# EAGLE board SSv3_1 (EAGLE 9.3.0), part 1 of 2
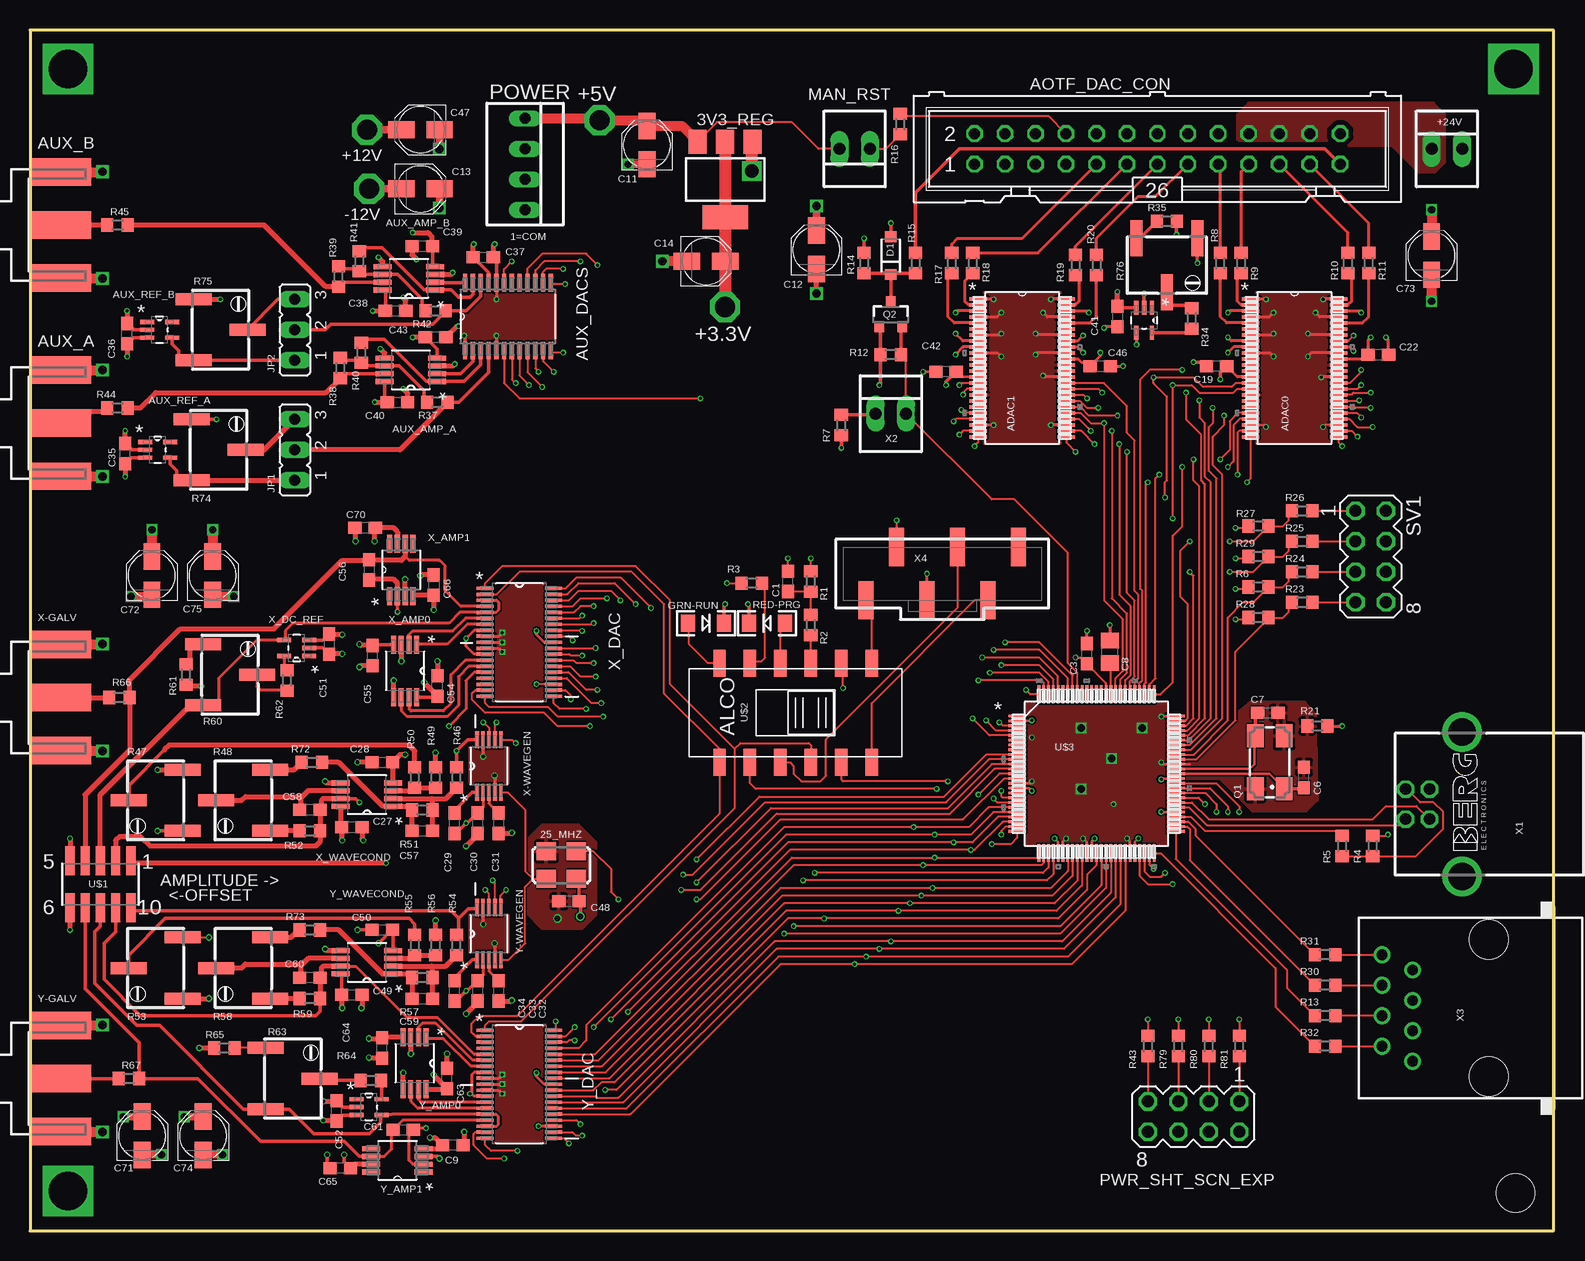
[diagram p6: board, top side]
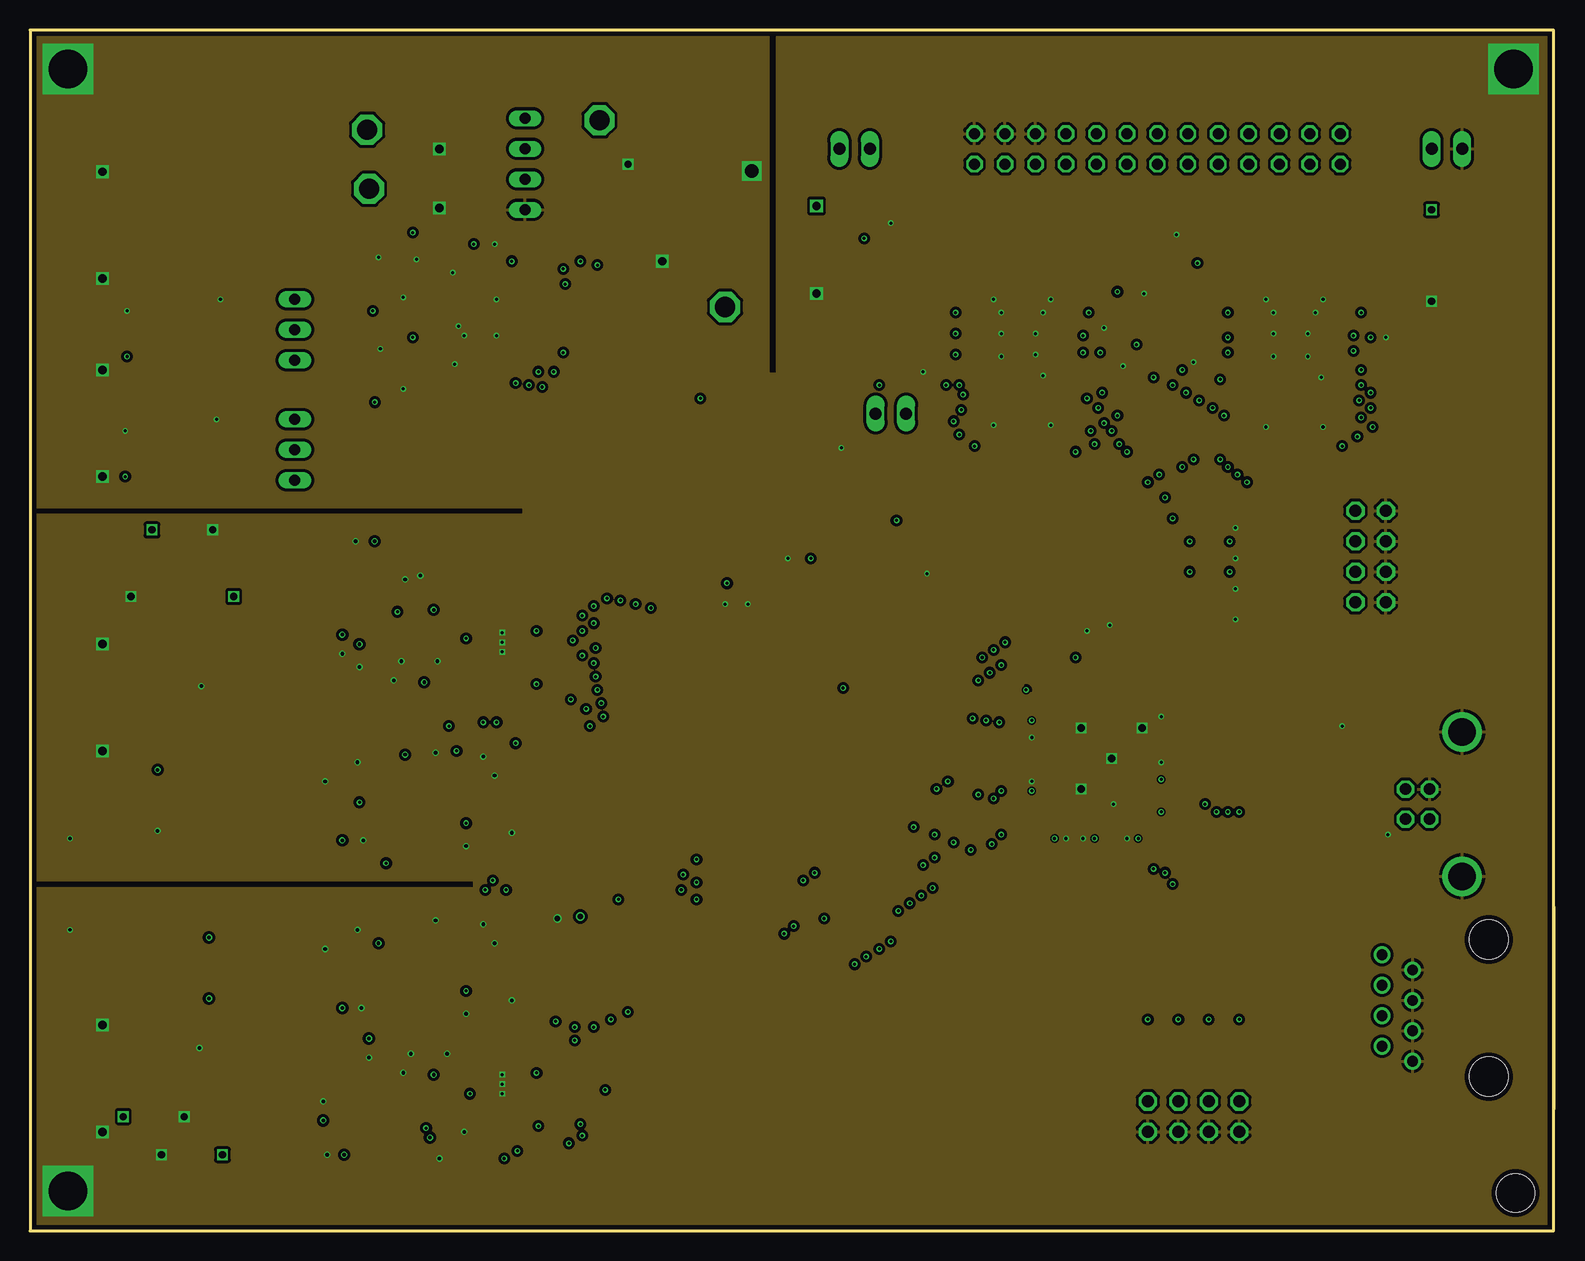
[diagram p7: board, inner layer AGND]
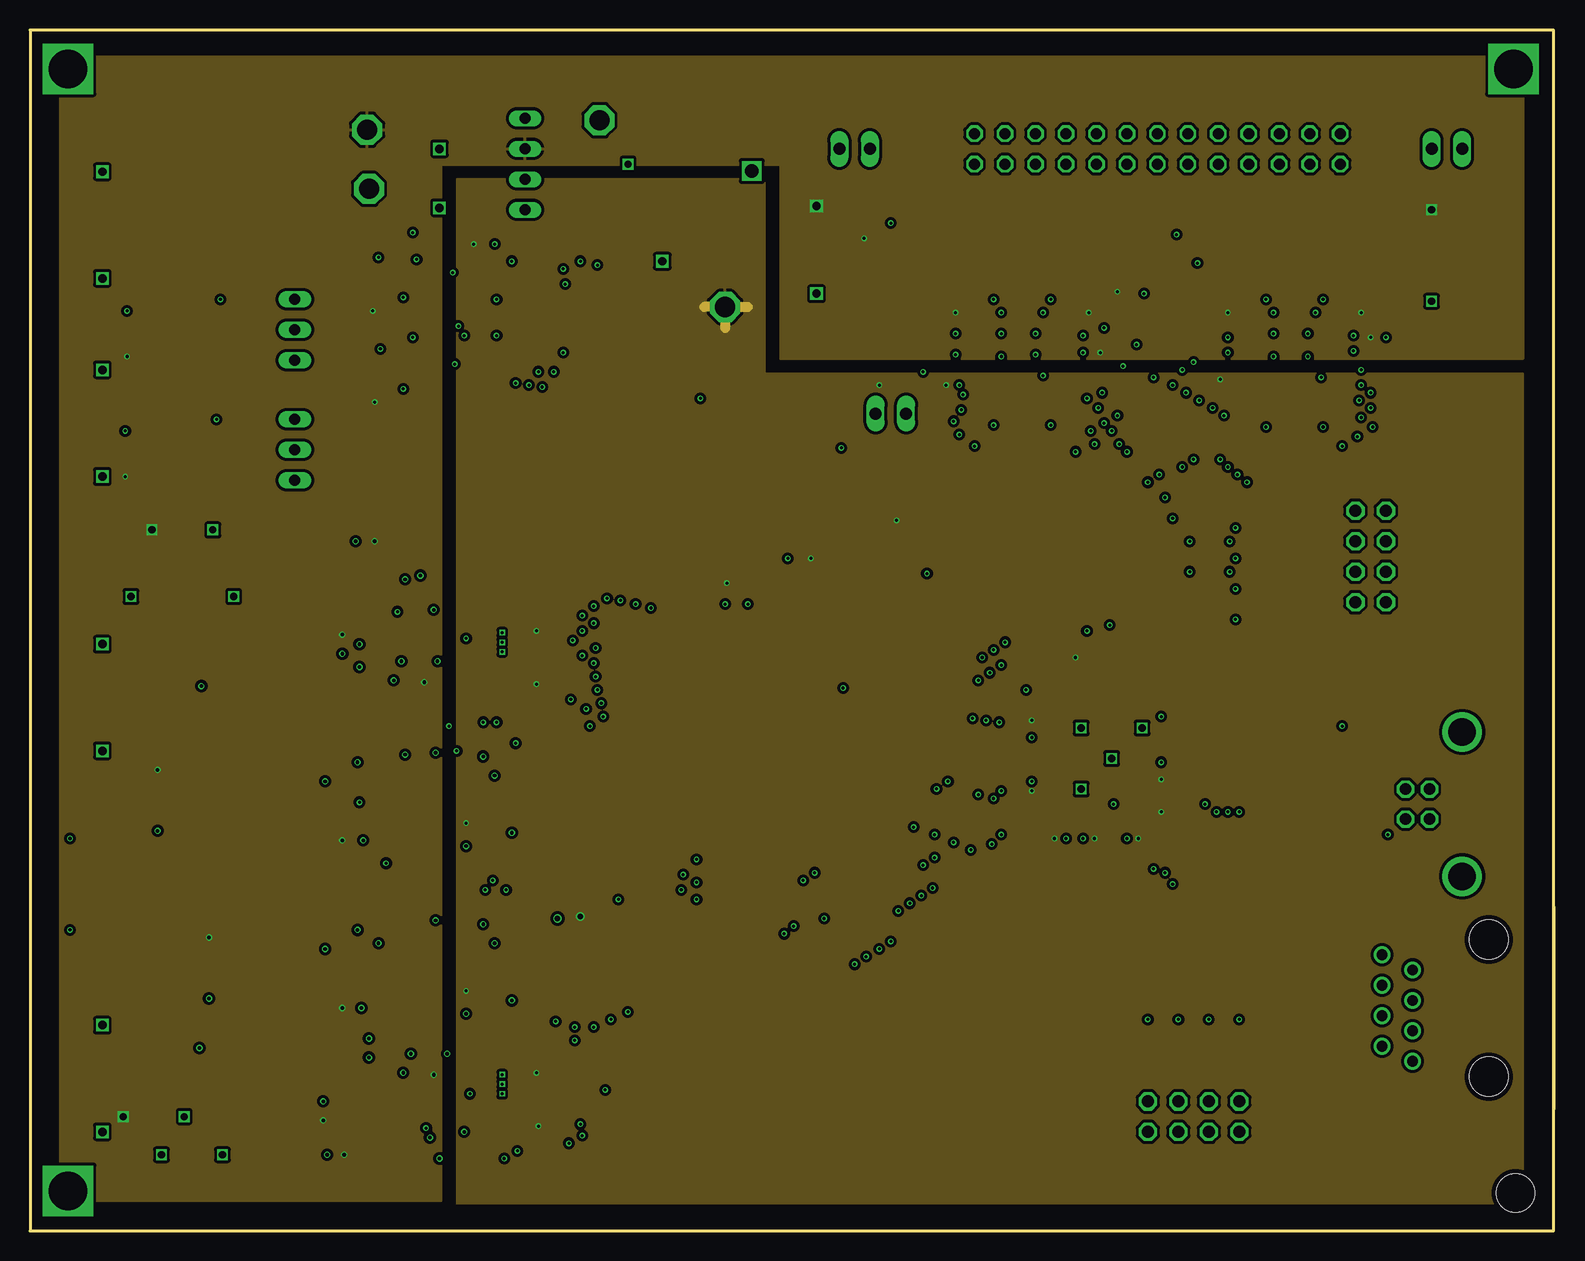
[diagram p8: board, inner layer VDD]
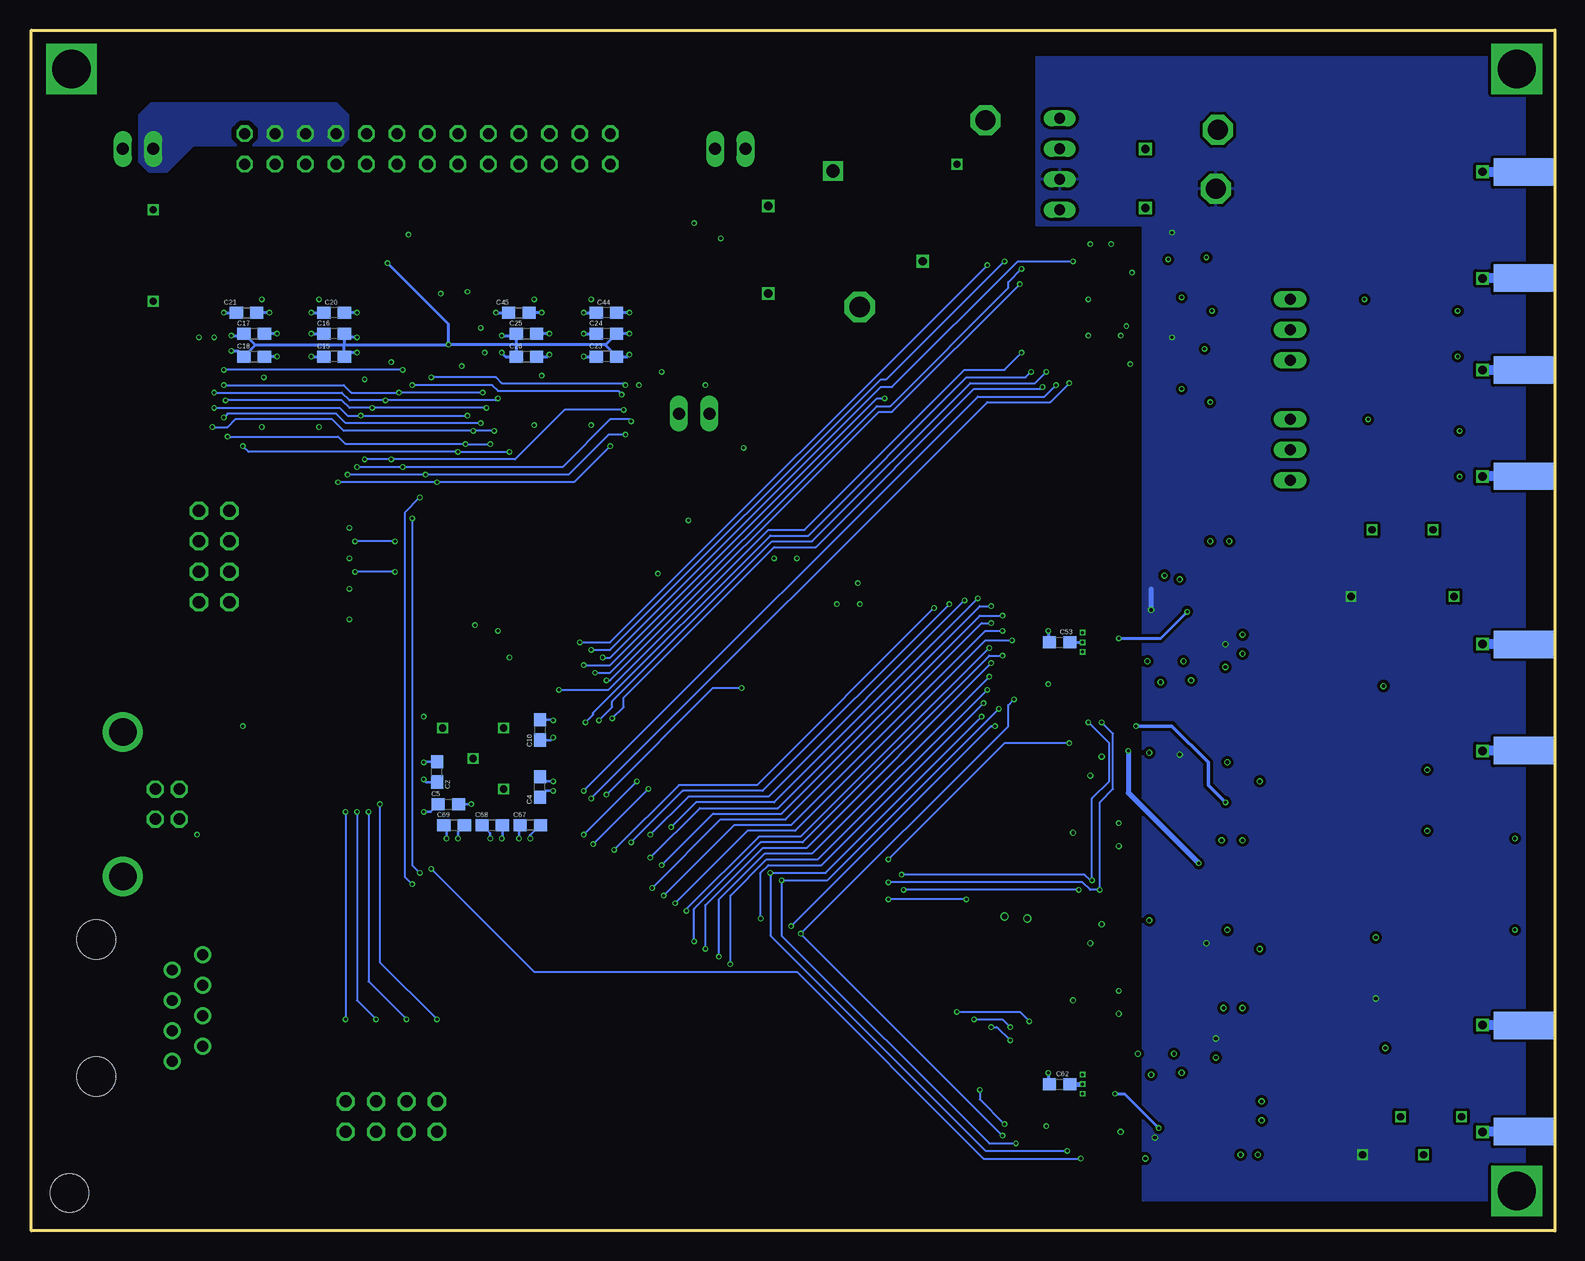
[diagram p9: board, bottom side, seen from below]

Size 127 x 100.08 mm. Coordinates in mm from the lower left corner, seen from the top.
Outline: 0,0 127,0 127,100.08 0,100.08 0,0
Copper layers (1*2*15*16): Top 0.035559375mm / dielectric 0.17018125mm / AGND 0.01778125mm / dielectric 47mil / VDD 0.01778125mm / dielectric 0.17018125mm / Bottom 0.035559375mm
Design rules "OSHPark_4layer": minimum track width 5mil, minimum drill 10mil, track to track 5mil, track to pad 5mil, pad to pad 5mil, via to via 5mil, smd to smd 5mil, copper to edge 15mil, drill to drill 6mil, minimum pad ring 4mil, minimum via ring 4mil, stop-mask expansion 2.5mil, vias tented up to drill 0mil, thermal gap 10mil
Holes 3.2 mm at 123.83,3.17
tKeepout: 2 lines

## Footprints (pad centres in the part's own frame; a part is rotated, then mirrored left to right if it is on the bottom)
SOT223 = smd 1.5 x 2: 1 -2.3,-3.15; 2 0,-3.15; 3 2.3,-3.15 | smd 3.8 x 2: 4 0,3.15
ASF = smd 1.6 x 1.5: 1 -1.25,-1.15; 2 1.25,-1.15; 3 1.25,1.15; 4 -1.25,1.15
TESTPOINT = drill 1.676 octagon: P$1 0,0
22-23-2021 = drill 1 long: 1 -1.27,0; 2 1.27,0
RV_48 = smd 1.473 x 0.279: 1 -3.67,5.75; 2 -3.67,5.25; 3 -3.67,4.75; 4 -3.67,4.25; 5 -3.67,3.75; 6 -3.67,3.25; 7 -3.67,2.75; 8 -3.67,2.25; 9 -3.67,1.75; 10 -3.67,1.25; 11 -3.67,0.75; 12 -3.67,0.25; 13 -3.67,-0.25; 14 -3.67,-0.75; 15 -3.67,-1.25; 16 -3.67,-1.75; 17 -3.67,-2.25; 18 -3.67,-2.75; 19 -3.67,-3.25; 20 -3.67,-3.75; 21 -3.67,-4.25; 22 -3.67,-4.75; 23 -3.67,-5.25; 24 -3.67,-5.75; 25 3.67,-5.75; 26 3.67,-5.25; 27 3.67,-4.75; 28 3.67,-4.25; 29 3.67,-3.75; 30 3.67,-3.25; 31 3.67,-2.75; 32 3.67,-2.25; 33 3.67,-1.75; 34 3.67,-1.25; 35 3.67,-0.75; 36 3.67,-0.25; 37 3.67,0.25; 38 3.67,0.75; 39 3.67,1.25; 40 3.67,1.75; 41 3.67,2.25; 42 3.67,2.75; 43 3.67,3.25; 44 3.67,3.75; 45 3.67,4.25; 46 3.67,4.75; 47 3.67,5.25; 48 3.67,5.75
SOT65P210X110-5N = smd 1.168 x 0.356: 1 -1.041,0.66; 2 -1.041,0; 3 -1.041,-0.66; 4 1.041,-0.66; 5 1.041,0.66
ML26 = drill 0.914 octagon: 1 -15.24,-1.27; 2 -15.24,1.27; 3 -12.7,-1.27; 4 -12.7,1.27; 5 -10.16,-1.27; 6 -10.16,1.27; 7 -7.62,-1.27; 8 -7.62,1.27; 9 -5.08,-1.27; 10 -5.08,1.27; 11 -2.54,-1.27; 12 -2.54,1.27; 13 0,-1.27; 14 0,1.27; 15 2.54,-1.27; 16 2.54,1.27; 17 5.08,-1.27; 18 5.08,1.27; 19 7.62,-1.27; 20 7.62,1.27; 21 10.16,-1.27; 22 10.16,1.27; 23 12.7,-1.27; 24 12.7,1.27; 25 15.24,-1.27; 26 15.24,1.27
SIDE_MOUNTSMA = smd 5.08 x 2.286: 1 2.565,0; G@1 2.565,4.42; G@2 2.565,-4.42 | smd 5.08 x 2.286 bottom: G@3 2.565,4.42; G@4 2.565,-4.42
SOP65P490X110-8N = smd 1.499 x 0.432: 1 -2.184,0.965; 2 -2.184,0.33; 3 -2.184,-0.33; 4 -2.184,-0.965; 5 2.184,-0.965; 6 2.184,-0.33; 7 2.184,0.33; 8 2.184,0.965
SOP65P640X120-24N = smd 1.473 x 0.356: 1 -2.819,3.581; 2 -2.819,2.921; 3 -2.819,2.286; 4 -2.819,1.626; 5 -2.819,0.965; 6 -2.819,0.33; 7 -2.819,-0.33; 8 -2.819,-0.965; 9 -2.819,-1.626; 10 -2.819,-2.286; 11 -2.819,-2.921; 12 -2.819,-3.581; 13 2.819,-3.581; 14 2.819,-2.921; 15 2.819,-2.286; 16 2.819,-1.626; 17 2.819,-0.965; 18 2.819,-0.33; 19 2.819,0.33; 20 2.819,0.965; 21 2.819,1.626; 22 2.819,2.286; 23 2.819,2.921; 24 2.819,3.581
C0603 = smd 1.1 x 1: 1 -0.85,0; 2 0.85,0
C0805 = smd 1.3 x 1.5: 1 -0.95,0; 2 0.95,0
PANASONIC_B = smd 2.2 x 1.4: + 1.6,0; - -1.6,0
SOD-123 = smd 0.9 x 0.95: A 1.575,0; C -1.575,0
LED-1206 = smd 1.2 x 1.4: A -1.5,0; C 1.5,0
JP2 = drill 0.914 long: 1 -2.54,0; 2 0,0; 3 2.54,0
22-23-2041 = drill 0.9 long: 1 3.81,0; 2 1.27,0; 3 -1.27,0; 4 -3.81,0
MA04-2 = drill 1.016 octagon: 1 -3.81,-1.27; 2 -3.81,1.27; 3 -1.27,-1.27; 4 -1.27,1.27; 5 1.27,-1.27; 6 1.27,1.27; 7 3.81,-1.27; 8 3.81,1.27
CTS406 = smd 1.9 x 1.4: 1 -2.2,-1.2; 2 2.2,-1.2; 3 2.2,1.2; 4 -2.2,1.2
SOT23-3 = smd 0.8 x 0.9: 1 -0.95,-1; 2 0.95,-1; 3 0,1.1
R0603 = smd 1 x 1.1: 1 -0.85,0; 2 0.85,0
RTRIMTS63Y = smd 1 x 3: 1 -2.55,-2.25; 2 0,2.25; 3 2.55,-2.25
SMD_HEADER_10P05_BARE = smd 0.76 x 2.4: 1 -2.54,-1.95; 2 -1.27,-1.95; 3 0,-1.95; 4 1.27,-1.95; 5 2.54,-1.95; 6 2.54,1.95; 7 1.27,1.95; 8 0,1.95; 9 -1.27,1.95; 10 -2.54,1.95
4PDT_SMD = smd 1.016 x 2.286: 1 -6.35,-4.128; 2 -3.81,-4.128; 3 -1.27,-4.128; 4 1.27,-4.128; 5 3.81,-4.128; 6 6.35,-4.128; 7 6.35,4.128; 8 3.81,4.128; 9 1.27,4.128; 10 -1.27,4.128; 11 -3.81,4.128; 12 -6.35,4.128
TQFP100_12X12MC = smd 1.473 x 0.229: 1 -6.617,4.8; 2 -6.617,4.4; 3 -6.617,4; 4 -6.617,3.6; 5 -6.617,3.2; 6 -6.617,2.8; 7 -6.617,2.4; 8 -6.617,2; 9 -6.617,1.6; 10 -6.617,1.2; 11 -6.617,0.8; 12 -6.617,0.4; 13 -6.617,0; 14 -6.617,-0.4; 15 -6.617,-0.8; 16 -6.617,-1.2; 17 -6.617,-1.6; 18 -6.617,-2; 19 -6.617,-2.4; 20 -6.617,-2.8; 21 -6.617,-3.2; 22 -6.617,-3.6; 23 -6.617,-4; 24 -6.617,-4.4; 25 -6.617,-4.8; 51 6.617,-4.8; 52 6.617,-4.4; 53 6.617,-4; 54 6.617,-3.6; 55 6.617,-3.2; 56 6.617,-2.8; 57 6.617,-2.4; 58 6.617,-2; 59 6.617,-1.6; 60 6.617,-1.2; 61 6.617,-0.8; 62 6.617,-0.4; 63 6.617,0; 64 6.617,0.4; 65 6.617,0.8; 66 6.617,1.2; 67 6.617,1.6; 68 6.617,2; 69 6.617,2.4; 70 6.617,2.8; 71 6.617,3.2; 72 6.617,3.6; 73 6.617,4; 74 6.617,4.4; 75 6.617,4.8 | smd 0.229 x 1.473: 26 -4.8,-6.617; 27 -4.4,-6.617; 28 -4,-6.617; 29 -3.6,-6.617; 30 -3.2,-6.617; 31 -2.8,-6.617; 32 -2.4,-6.617; 33 -2,-6.617; 34 -1.6,-6.617; 35 -1.2,-6.617; 36 -0.8,-6.617; 37 -0.4,-6.617; 38 0,-6.617; 39 0.4,-6.617; 40 0.8,-6.617; 41 1.2,-6.617; 42 1.6,-6.617; 43 2,-6.617; 44 2.4,-6.617; 45 2.8,-6.617; 46 3.2,-6.617; 47 3.6,-6.617; 48 4,-6.617; 49 4.4,-6.617; 50 4.8,-6.617; 76 4.8,6.617; 77 4.4,6.617; 78 4,6.617; 79 3.6,6.617; 80 3.2,6.617; 81 2.8,6.617; 82 2.4,6.617; 83 2,6.617; 84 1.6,6.617; 85 1.2,6.617; 86 0.8,6.617; 87 0.4,6.617; 88 0,6.617; 89 -0.4,6.617; 90 -0.8,6.617; 91 -1.2,6.617; 92 -1.6,6.617; 93 -2,6.617; 94 -2.4,6.617; 95 -2.8,6.617; 96 -3.2,6.617; 97 -3.6,6.617; 98 -4,6.617; 99 -4.4,6.617; 100 -4.8,6.617
PN61729-S = drill 0.95 octagon: 1 1.25,4.71; 2 -1.25,4.71; 3 -1.25,2.71; 4 1.25,2.71 | drill 2.3 pad 2.9: S1 -6.02,0; S2 6.02,0
RJ45-NO-SHIELD = drill 0.9 pad 1.4: 1 -4.445,6.35; 2 -3.175,8.89; 3 -1.905,6.35; 4 -0.635,8.89; 5 0.635,6.35; 6 1.905,8.89; 7 3.175,6.35; 8 4.445,8.89 | hole 3.251: -5.715,0; 5.715,0
74099-06 = smd 1.27 x 3.175: 1 -6.35,-2.223; 2 -3.81,2.223; 3 -1.27,-2.223; 4 1.27,2.223; 5 3.81,-2.223; 6 6.35,2.223
SOP50P490X110-10N = smd 1.422 x 0.305: 1 -2.184,0.991; 2 -2.184,0.508; 3 -2.184,0; 4 -2.184,-0.508; 5 -2.184,-0.991; 6 2.184,-0.991; 7 2.184,-0.508; 8 2.184,0; 9 2.184,0.508; 10 2.184,0.991
SOP50P640X120-38N = smd 1.422 x 0.279: 1 -2.845,4.496; 2 -2.845,3.988; 3 -2.845,3.505; 4 -2.845,2.997; 5 -2.845,2.489; 6 -2.845,2.007; 7 -2.845,1.499; 8 -2.845,0.991; 9 -2.845,0.508; 10 -2.845,0; 11 -2.845,-0.508; 12 -2.845,-0.991; 13 -2.845,-1.499; 14 -2.845,-2.007; 15 -2.845,-2.489; 16 -2.845,-2.997; 17 -2.845,-3.505; 18 -2.845,-3.988; 19 -2.845,-4.496; 20 2.845,-4.496; 21 2.845,-3.988; 22 2.845,-3.505; 23 2.845,-2.997; 24 2.845,-2.489; 25 2.845,-2.007; 26 2.845,-1.499; 27 2.845,-0.991; 28 2.845,-0.508; 29 2.845,0; 30 2.845,0.508; 31 2.845,0.991; 32 2.845,1.499; 33 2.845,2.007; 34 2.845,2.489; 35 2.845,2.997; 36 2.845,3.505; 37 2.845,3.988; 38 2.845,4.496

## Placement (x,y rotation side)
3V3_REG  AP1117  [SOT223]  57.94,87.63 180 top
25_MHZ  ASFL1  [ASF]  44.29,30.48 180 top
+3.3V  TESTPOINT  [TESTPOINT]  57.94,76.99 90 top
+5V  TESTPOINT  [TESTPOINT]  47.47,92.55 180 top
+12V  TESTPOINT  [TESTPOINT]  28.1,91.76 180 top
+24V  AOTF_SUPPLY  [22-23-2021]  118.11,90.17 0 top
-12V  TESTPOINT  [TESTPOINT]  28.26,86.84 180 top
ADAC0  AD5583YRVZ  [RV_48]  105.41,71.91 0 top
ADAC1  AD5583YRVZ  [RV_48]  82.71,71.91 0 top
ADAC_REF  ADR01  [SOT65P210X110-5N]  92.87,75.88 270 top
AOTF_DAC_CON  TO_PNLMNT_DB25  [ML26]  93.98,90.17 0 top
AUX_A  [SIDE_MOUNTSMA]  0,67.31 0 top
AUX_AMP_A  OP2177  [SOP65P490X110-8N]  31.75,71.75 180 top
AUX_AMP_B  OP2177  [SOP65P490X110-8N]  31.59,79.38 180 top
AUX_B  [SIDE_MOUNTSMA]  0,83.82 0 top
AUX_DACS  AD5440YRUZ  [SOP65P640X120-24N]  39.85,76.2 90 top
AUX_REF_A  ADR01  [SOT65P210X110-5N]  10.64,65.09 0 top
AUX_REF_B  ADR01  [SOT65P210X110-5N]  10.79,75.09 0 top
C1  0.1uF  [C0603]  63.18,54.13 90 top
C2  0.1uF  [C0603]  93.19,38.26 90 bottom
C3  0.1uF  [C0603]  88.11,48.1 90 top
C4  0.1uF  [C0603]  84.61,36.99 90 bottom
C5  0.1uF  [C0603]  92.23,35.56 0 bottom
C6  30pF  [C0603]  106.2,37.78 90 top
C7  30pF  [C0603]  103.19,43.18 0 top
C8  10uF  [C0805]  90.01,48.26 90 top
C9  0.1uF  [C0603]  35.24,7.14 180 top
C10  0.1uF  [C0603]  84.61,41.75 270 bottom
C11  10uF  [PANASONIC_B]  51.44,90.49 90 top
C12  10uF  [PANASONIC_B]  65.56,81.76 90 top
C13  10uF  [PANASONIC_B]  32.54,86.84 0 top
C14  10uF  [PANASONIC_B]  56.36,80.8 0 top
C15  0.1uF  [C0603]  101.76,72.87 180 bottom
C16  0.1uF  [C0603]  101.76,74.77 180 bottom
C17  0.1uF  [C0603]  108.43,74.77 0 bottom
C18  0.1uF  [C0603]  108.43,72.87 0 bottom
C19  0.1uF  [C0603]  98.9,72.07 180 top
C20  0.1uF  [C0603]  101.76,76.52 180 bottom
C21  0.1uF  [C0603]  109.06,76.52 0 bottom
C22  0.1uF  [C0603]  112.39,73.03 0 top
C23  0.1uF  [C0603]  79.06,72.87 180 bottom
C24  0.1uF  [C0603]  79.06,74.77 180 bottom
C25  0.1uF  [C0603]  85.72,74.77 0 bottom
C26  0.1uF  [C0603]  85.72,72.87 0 bottom
C27  0.1uF  [C0603]  26.83,33.66 0 top
C28  0.1uF  [C0603]  29.37,39.05 0 top
C29  0.01uF  [C0603]  35.4,33.97 90 top
C30  0.1uF  [C0603]  37.31,33.97 270 top
C31  0.1uF  [C0603]  39.05,33.97 270 top
C32  0.1uF  [C0603]  39.05,20 270 top
C33  0.1uF  [C0603]  37.31,20 270 top
C34  0.01uF  [C0603]  35.4,20 90 top
C35  0.1uF  [C0603]  7.94,64.77 90 top
C36  0.1uF  [C0603]  8.1,74.77 90 top
C37  0.1uF  [C0603]  37.78,81.12 0 top
C38  0.1uF  [C0603]  30.48,76.68 0 top
C39  0.1uF  [C0603]  32.7,82.07 0 top
C40  0.1uF  [C0603]  30.64,69.06 0 top
C41  0.1uF  [C0603]  90.65,76.2 270 top
C42  0.1uF  [C0603]  76.36,71.6 180 top
C43  0.1uF  [C0603]  33.81,74.45 180 top
C44  0.1uF  [C0603]  79.06,76.52 180 bottom
C45  0.1uF  [C0603]  86.36,76.52 0 bottom
C46  0.1uF  [C0603]  89.22,72.07 0 top
C47  10uF  [PANASONIC_B]  32.54,91.76 180 top
C48  0.1uF  [C0603]  44.93,27.46 180 top
C49  0.1uF  [C0603]  26.83,19.68 0 top
C50  0.1uF  [C0603]  29.37,25.08 0 top
C51  0.1uF  [C0603]  24.92,48.9 270 top
C52  0.1uF  [C0603]  25.56,10 90 top
C53  0.1uF  [C0603]  41.27,49.05 0 bottom
C54  0.1uF  [C0603]  33.97,45.4 90 top
C55  0.1uF  [C0603]  28.57,47.94 90 top
C56  OPT  [C0603]  28.26,55.09 270 top
C57  OPT  [C0603]  32.7,33.34 0 top
C58  OPT  [C0603]  23.34,35.08 180 top
C59  OPT  [C0603]  32.7,19.37 0 top
C60  OPT  [C0603]  23.34,21.11 180 top
C61  OPT  [C0603]  31.11,8.41 0 top
C62  0.1uF  [C0603]  41.27,12.22 0 bottom
C63  0.1uF  [C0603]  34.77,12.7 90 top
C64  0.1uF  [C0603]  29.37,15.24 90 top
C65  0.1uF  [C0603]  25.88,5.24 180 top
C66  0.1uF  [C0603]  33.66,53.82 270 top
C67  0.1uF  [C0603]  85.41,33.81 180 bottom
C68  0.1uF  [C0603]  88.58,33.81 0 bottom
C69  0.1uF  [C0603]  91.76,33.81 0 bottom
C70  0.1uF  [C0603]  27.94,58.58 180 top
C71  10uF  [PANASONIC_B]  9.37,7.94 90 top
C72  10uF  [PANASONIC_B]  10.16,54.61 90 top
C73  10uF  [PANASONIC_B]  116.84,81.28 90 top
C74  10uF  [PANASONIC_B]  14.45,7.94 90 top
C75  10uF  [PANASONIC_B]  15.24,54.61 90 top
D1  10V  [SOD-123]  71.75,81.28 90 top
GRN-RUN  1206_SMD  [LED-1206]  56.36,50.64 0 top
JP1  [JP2]  22.07,65.09 90 top
JP2  [JP2]  22.07,75.09 90 top
MAN_RST  EXT_PB  [22-23-2021]  68.74,90.17 180 top
POWER  GND_-12_+12_+5  [22-23-2041]  41.27,88.9 270 top
PWR_SHT_SCN_EXP  [MA04-2]  97,9.53 180 top
Q1  20.000_MHZ  [CTS406]  103.35,39.05 90 top
Q2  200mA/50V  [SOT23-3]  71.75,76.36 0 top
R1  10k  [R0603]  65.09,54.13 270 top
R2  470  [R0603]  65.09,50.48 270 top
R3  470  [R0603]  60.17,53.98 0 top
R4  100K  [R0603]  111.92,32.07 270 top
R5  100  [R0603]  109.38,32.07 90 top
R6  100K  [R0603]  102.39,53.66 180 top
R7  270  [R0603]  67.63,67.15 90 top
R8  10  [R0603]  99.22,80.64 90 top
R9  10  [R0603]  100.97,80.64 90 top
R10  10  [R0603]  109.86,80.64 90 top
R11  10  [R0603]  111.6,80.64 90 top
R12  10K  [R0603]  71.75,73.03 180 top
R13  100  [R0603]  107.95,17.94 180 top
R14  1K  [R0603]  69.53,80.64 90 top
R15  10  [R0603]  73.82,80.64 270 top
R16  100  [R0603]  72.55,92.23 90 top
R17  10  [R0603]  76.83,80.64 90 top
R18  10  [R0603]  78.58,80.64 90 top
R19  10  [R0603]  87.15,80.49 90 top
R20  10  [R0603]  88.9,80.49 90 top
R21  0  [R0603]  107.31,42.07 0 top
R23  50  [R0603]  106.05,52.39 180 top
R24  50  [R0603]  106.05,54.93 180 top
R25  50  [R0603]  106.05,57.47 180 top
R26  50  [R0603]  106.05,60.01 180 top
R27  100K  [R0603]  102.39,58.74 180 top
R28  100K  [R0603]  102.39,51.12 180 top
R29  100K  [R0603]  102.39,56.2 180 top
R30  100  [R0603]  107.95,20.48 180 top
R31  100  [R0603]  107.95,23.02 180 top
R32  100  [R0603]  107.95,15.4 180 top
R34  470k  [R0603]  96.84,76.04 90 top
R35  1k  [R0603]  94.77,84.14 180 top
R37  20K  [R0603]  33.97,69.06 180 top
R38  20K  [R0603]  25.88,71.91 90 top
R39  20K  [R0603]  25.72,79.53 270 top
R40  10K  [R0603]  27.62,73.18 90 top
R41  10K  [R0603]  27.46,80.8 90 top
R42  20K  [R0603]  33.81,76.68 180 top
R43  270  [R0603]  93.19,15.4 90 top
R44  50  [R0603]  7.3,68.58 180 top
R45  50  [R0603]  7.3,83.82 180 top
R46  20K  [R0603]  35.56,37.78 270 top
R47  50K  [RTRIMTS63Y]  10.48,35.88 90 top
R48  10K  [RTRIMTS63Y]  17.78,35.88 90 top
R49  1K  [R0603]  33.81,37.78 270 top
R50  30K  [R0603]  32.07,37.78 270 top
R51  20K  [R0603]  32.7,35.08 180 top
R52  47K  [R0603]  23.34,33.34 0 top
R53  50K  [RTRIMTS63Y]  10.48,21.91 90 top
R54  20K  [R0603]  35.56,23.81 270 top
R55  30K  [R0603]  32.07,23.81 270 top
R56  1K  [R0603]  33.81,23.81 270 top
R57  20K  [R0603]  32.7,21.11 180 top
R58  10K  [RTRIMTS63Y]  17.78,21.91 90 top
R59  47K  [R0603]  23.34,19.37 0 top
R60  10K  [RTRIMTS63Y]  16.67,46.35 270 top
R61  1K  [R0603]  13.02,46.35 90 top
R62  470K  [R0603]  21.43,45.88 270 top
R63  10K  [RTRIMTS63Y]  21.91,12.7 270 top
R64  470K  [R0603]  28.42,12.54 180 top
R65  1K  [R0603]  16.19,15.24 0 top
R66  50  [R0603]  7.46,44.45 0 top
R67  50  [R0603]  8.26,12.7 0 top
R72  3.3K  [R0603]  23.5,39.05 0 top
R73  3.3K  [R0603]  23.34,25.08 0 top
R74  50K  [RTRIMTS63Y]  15.72,65.09 270 top
R75  50K  [RTRIMTS63Y]  15.88,75.09 270 top
R76  10K  [RTRIMTS63Y]  94.77,80.49 180 top
R79  270  [R0603]  95.73,15.4 90 top
R80  270  [R0603]  98.27,15.4 90 top
R81  270  [R0603]  100.81,15.4 90 top
RED-PRG  1206_SMD  [LED-1206]  61.44,50.64 180 top
SV1  [MA04-2]  111.76,56.2 270 top
U$1  HEADER_SMD_10P05_BARE  [SMD_HEADER_10P05_BARE]  5.87,28.89 180 top
U$2  4PDT  [4PDT_SMD]  63.82,43.18 0 top
U$3  PIC24FJ256GB210-I/PT  [TQFP100_12X12MC]  88.9,38.1 0 top
X1  PN61729-S  [PN61729-S]  119.38,35.56 90 top
X2  SCAN_LED  [22-23-2021]  71.75,68.1 0 top
X3  RJ45-6L-B  [RJ45-NO-SHIELD]  121.6,18.57 90 top
X4  C-GRID-06-74099  [74099-06]  76.04,54.77 0 top
X-GALV  [SIDE_MOUNTSMA]  0,44.45 0 top
X-WAVEGEN  AD9833BRMZ  [SOP50P490X110-10N]  38.26,38.73 90 top
X_AMP0  AD8676BRMZ  [SOP65P490X110-8N]  31.27,46.67 270 top
X_AMP1  AD8675ARMZ  [SOP65P490X110-8N]  30.96,55.09 90 top
X_DAC  AD5547CRUZ  [SOP50P640X120-38N]  40.8,49.05 0 top
X_DC_REF  ADR01  [SOT65P210X110-5N]  22.23,48.58 180 top
X_WAVECOND  AD8676BRMZ  [SOP65P490X110-8N]  28.1,36.35 180 top
Y-GALV  [SIDE_MOUNTSMA]  0,12.7 0 top
Y-WAVEGEN  AD9833BRMZ  [SOP50P490X110-10N]  38.26,24.77 90 top
Y_AMP0  AD8676BRMZ  [SOP65P490X110-8N]  32.07,13.97 270 top
Y_AMP1  AD8675ARMZ  [SOP65P490X110-8N]  30.64,5.87 180 top
Y_DAC  AD5547CRUZ  [SOP50P640X120-38N]  40.8,12.22 0 top
Y_DC_REF  ADR01  [SOT65P210X110-5N]  28.26,10.32 0 top
Y_WAVECOND  AD8676BRMZ  [SOP65P490X110-8N]  28.1,22.38 180 top